# EAGLE design OpenServoCAN_Power_Board_V_1_0_1 (EAGLE 9.6.2)
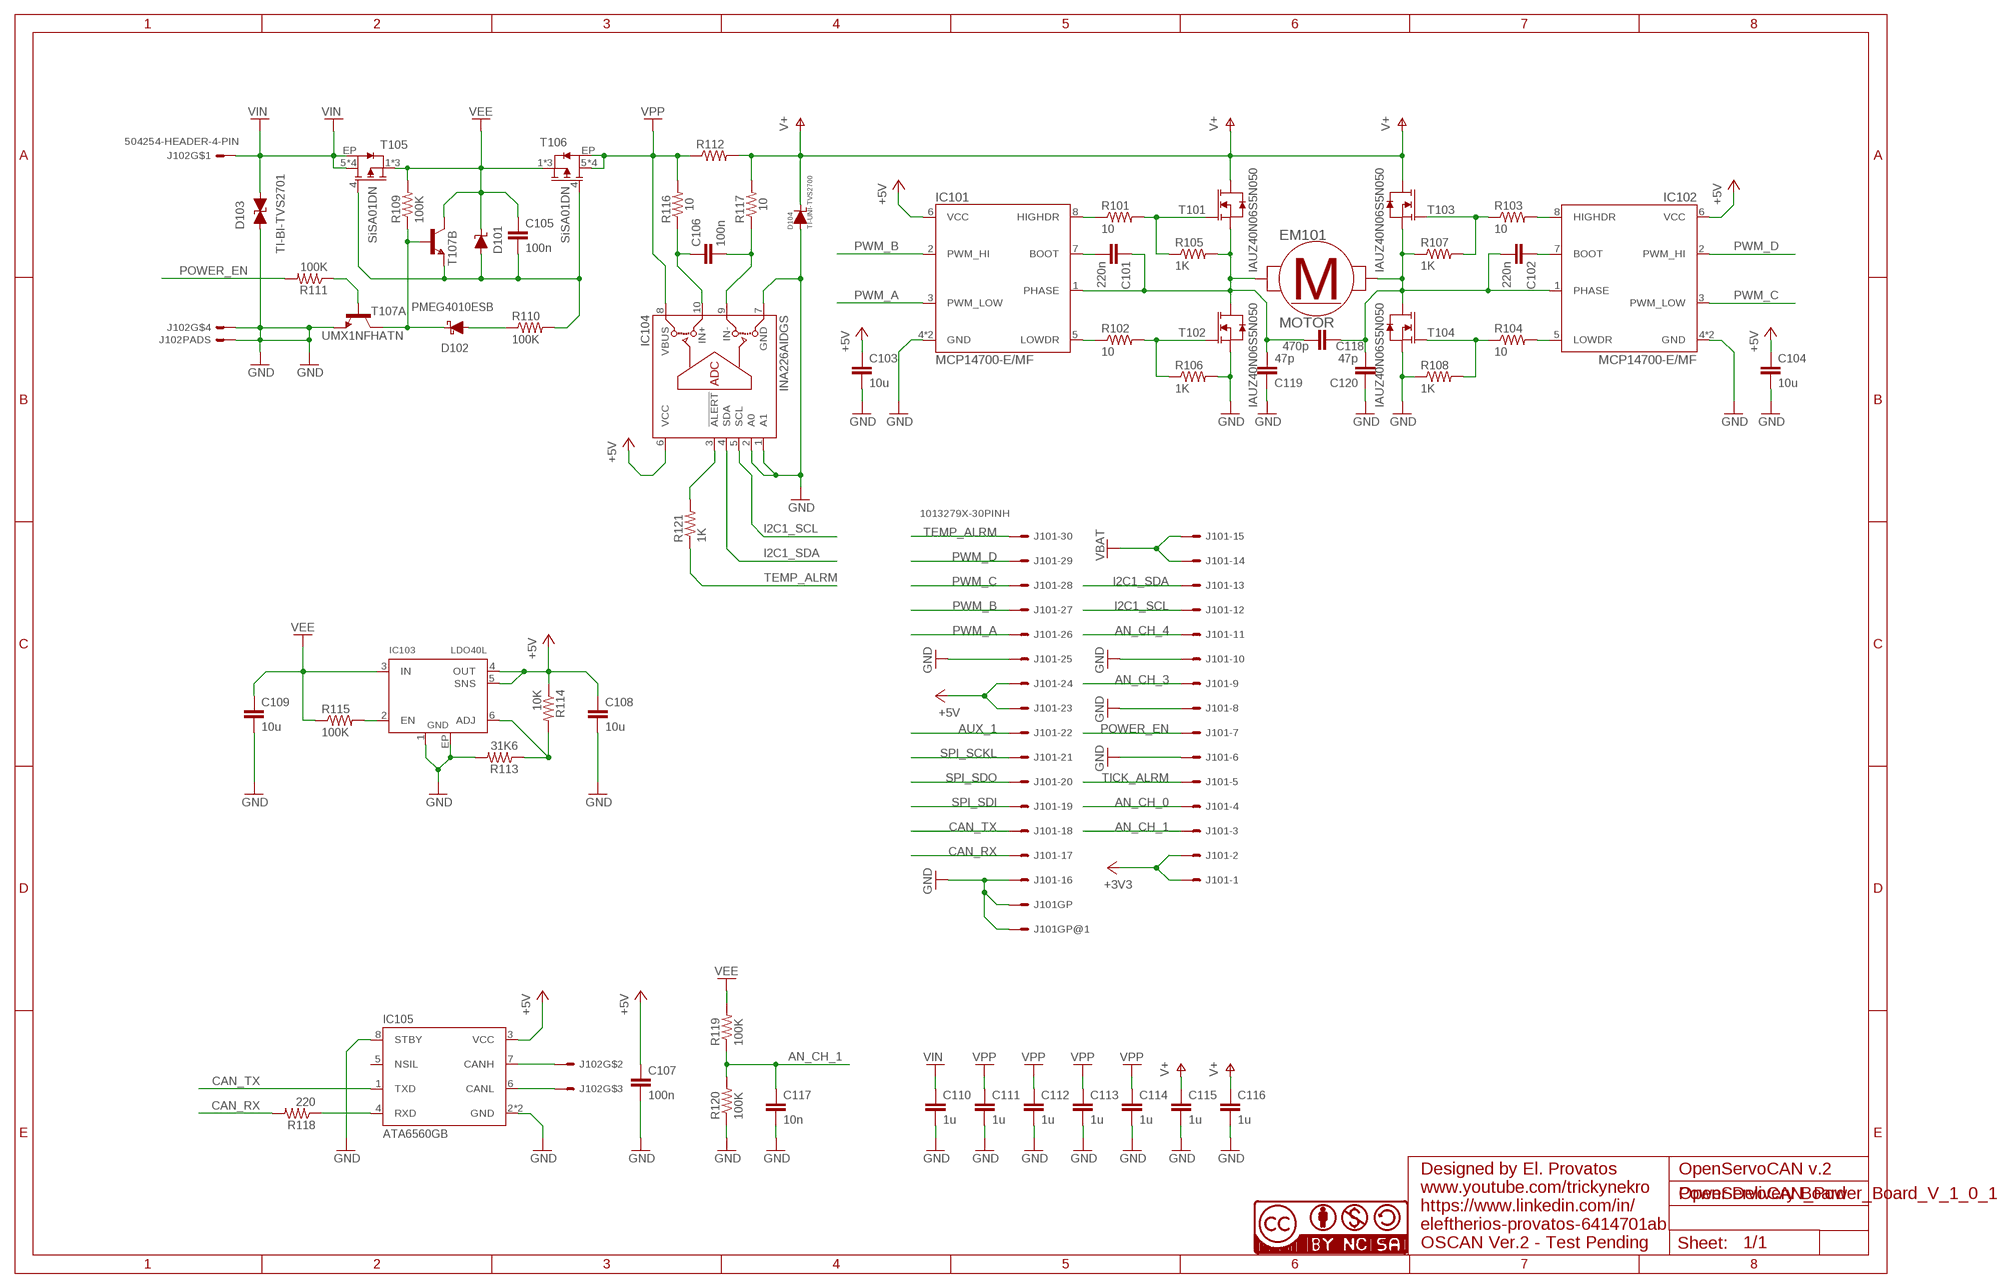
[diagram p0: schematic, sheet 1]

## Parts
C101  220n  C-EUC0603  [0603_C]
C102  220n  C-EUC0603  [0603_C]
C103  10u  C-EUC0402  [0402_C]
C104  10u  C-EUC0402  [0402_C]
C105  100n  C-EUC0402  [0402_C]
C106  100n  C-EUC0402  [0402_C]
C107  100n  C-EUC0402  [0402_C]
C108  10u  C-EUC0402  [0402_C]
C109  10u  C-EUC0402  [0402_C]
C110  1u  C-EUC0603  [0603_C]
C111  1u  C-EUC0603  [0603_C]
C112  1u  C-EUC0603  [0603_C]
C113  1u  C-EUC0603  [0603_C]
C114  1u  C-EUC0603  [0603_C]
C115  1u  C-EUC0603  [0603_C]
C116  1u  C-EUC0603  [0603_C]
C117  10n  C-EUC0402  [0402_C]
C118  470p  C-EUC1206  [1206_C]
C119  47p  C-EUC1206  [1206_C]
C120  47p  C-EUC1206  [1206_C]
D101  DDZ12CSF  [SOD-323]
D102  PMEG4010ESB  [DSN1006-2]
D103  TI-BI-TVS2701  [VSON-8-DRB0008A]
D104  TI-UNI-TVS2700  [WSON-6]
EM101  MOTOR  [RF-020TH-10210]
IC101  MCP14700-E/MF  [DFN_8_3X3X09_MF_MICROCHIP]
IC102  MCP14700-E/MF  [DFN_8_3X3X09_MF_MICROCHIP]
IC103  LDO40L  LDO40L-ADJ  [DFN6-3X3]
IC104  INA226AIDGS  [VSSOP-10]
IC105  ATA6560GB  [VDFN-8-EP]
J101  1013279X-30PINH  [10132797-30]
J102  504254-HEADER-4-PIN  [504254]
R101  10  R-USR0402  [0402_R]
R102  10  R-USR0402  [0402_R]
R103  10  R-USR0402  [0402_R]
R104  10  R-USR0402  [0402_R]
R105  1K  R-USR0402  [0402_R]
R106  1K  R-USR0402  [0402_R]
R107  1K  R-USR0402  [0402_R]
R108  1K  R-USR0402  [0402_R]
R109  100K  R-USR0402  [0402_R]
R110  100K  R-USR0402  [0402_R]
R111  100K  R-USR0402  [0402_R]
R112  TLR2HW-R-US-SENSE  [TLR2HW]
R113  31K6  R-USR0402  [0402_R]
R114  10K  R-USR0402  [0402_R]
R115  100K  R-USR0402  [0402_R]
R116  10  R-USR0402  [0402_R]
R117  10  R-USR0402  [0402_R]
R118  220  R-USR0402  [0402_R]
R119  100K  R-USR0402  [0402_R]
R120  100K  R-USR0402  [0402_R]
R121  1K  R-USR0402  [0402_R]
T101  IAUZ40N06S5N050  [PG-TSDSON-8-33-INF]
T102  IAUZ40N06S5N050  [PG-TSDSON-8-33-INF]
T103  IAUZ40N06S5N050  [PG-TSDSON-8-33-INF]
T104  IAUZ40N06S5N050  [PG-TSDSON-8-33-INF]
T105  SiSA01DN  SISA01DN  [POWERPAK-1212-8-SINGLE]
T106  SiSA01DN  SISA01DN  [POWERPAK-1212-8-SINGLE]
T107  UMX1NFHATN  [SC-70-6]
U$1  CC-NC-BCNIX  [CC-NC-B_NIX]

## Nets
+3V3: J101.1 J101.2
+5V: C103.1 C104.1 C107.1 C108.1 IC101.6(VCC) IC102.6(VCC) IC103.4(OUT) IC103.5(SNS) IC104.6(VCC) IC105.3(VCC) J101.23 J101.24 R114.1
AN_CH_0: J101.4
AN_CH_1: C117.1 J101.3 R119.1 R120.2
AN_CH_3: J101.9
AN_CH_4: J101.11
AUX_1: J101.22
CAN_RX: J101.17 R118.2
CAN_TX: IC105.1(TXD) J101.18
GND: C103.2 C104.2 C107.2 C108.2 C109.2 C110.2 C111.2 C112.2 C113.2 C114.2 C115.2 C116.2 C117.2 C119.1 C120.1 D103.5(A) D103.6(A) D103.7(A) D103.8(A) D104.1(A) D104.2(A) D104.3(A) D104.EP(A) IC101.4(GND) IC101.EP(GND) IC102.4(GND) IC102.EP(GND) IC103.1(GND) IC103.EP(GND) IC104.1(A1) IC104.2(A0) IC104.7(GND) IC105.2(GND) IC105.8(STBY) IC105.EP(GND) J101.6 J101.8 J101.10 J101.16 J101.25 J101.EP@2 J101.EP@↑1 J102.4 J102.EP@1 J102.EP@2 J102.EP@3 J102.EP@4 R106.2 R108.1 R113.2 R120.1 T102.S T104.S T107.1(A:E)
I2C1_SCL: IC104.5(SCL) J101.12
I2C1_SDA: IC104.4(SDA) J101.13
N$1: C101.1 C118.2 C119.2 EM101.1B EM101.1T IC101.1(PHASE) R105.2 T101.S T102.D
N$2: C102.2 C118.1 C120.2 EM101.2B EM101.2T IC102.1(PHASE) R107.1 T103.S T104.D
N$3: R103.1 R107.2 T103.G
N$4: IC101.8(HIGHDR) R101.1
N$5: R101.2 R105.1 T101.G
N$6: IC102.8(HIGHDR) R103.2
N$7: IC104.3(!ALERT) R121.2
N$8: R102.2 R106.1 T102.G
N$9: IC101.5(LOWDR) R102.1
N$10: R104.1 R108.2 T104.G
N$11: IC102.5(LOWDR) R104.2
N$13: C102.1 IC102.7(BOOT)
N$14: IC103.6(ADJ) R113.1 R114.2
N$15: C101.2 IC101.7(BOOT)
N$16: IC103.2(EN) R115.2
N$19: C106.1 IC104.10(IN+) R116.1
N$20: C106.2 IC104.9(IN-) R117.1
N$21: IC105.7(CANH) J102.2
N$22: IC105.6(CANL) J102.3
N$24: D102.K R109.1 T107.5(B:B) T107.6(A:C)
N$26: D102.A R110.1
N$27: C105.2 D101.A R110.2 T105.4(G) T106.4(G) T107.4(B:E)
N$28: R111.1 T107.2(A:B)
N$29: IC105.4(RXD) R118.1
POWER_EN: J101.7 R111.2
PWM_A: IC101.3(PWM_LOW) J101.26
PWM_B: IC101.2(PWM_HI) J101.27
PWM_C: IC102.3(PWM_LOW) J101.28
PWM_D: IC102.2(PWM_HI) J101.29
SPI_SCKL: J101.21
SPI_SDI: J101.19
SPI_SDO: J101.20
TEMP_ALRM: J101.30 R121.1
TICK_ALRM: J101.5
V+: C115.1 C116.1 D104.4(K) D104.5(K) D104.6(K) R112.2 R117.2 T101.D T103.D
VBAT: J101.14 J101.15
VEE: C105.1 C109.1 D101.K IC103.3(IN) R109.2 R115.1 R119.2 T105.1(S) T105.2(S) T105.3(S) T106.1(S) T106.2(S) T106.3(S) T107.3(B:C)
VIN: C110.1 D103.1(K) D103.2(K) D103.3(K) D103.4(K) J102.1 T105.5(D) T105.6(D) T105.7(D) T105.8(D) T105.EP(D)
VPP: C111.1 C112.1 C113.1 C114.1 IC104.8(VBUS) R112.1 R116.2 T106.5(D) T106.6(D) T106.7(D) T106.8(D) T106.EP(D)
Unconnected: IC105.5(NSIL)

## Notes on the sheet
- Designed by El. Provatos | OpenServoCAN v.2
- www.youtube.com/trickynekro
- Power Delivery Board
- https://www.linkedin.com/in/
  eleftherios-provatos-6414701ab
- OSCAN Ver.2 - Test Pending

## Library data of the parts
C101-C120 = TRN_Open_Servo:C-EUC: Standard 0402 Capacitor with European Symbol
D101 = TRN_Open_Servo:DDZ12: DDZ12CSF 0.5W SURFACE MOUNT PRECISION 12V ZENER DIODE from Diodes Incorporated in SOD-323F-2 Package Features 500mW Power Dissipation on FR-4 PCB Very Tight Tolerance on Vz Ideally Suited for Automated Assembly Processes Totally Lead-Free & Fully RoHS Compliant Halogen and Antimony Free.
D102 = TRN_Open_Servo:PMEG4010: PMEG4010 Schottky Barrier Diode 40V 1A Planar Maximum Efficiency General Application (MEGA) Schottky barrier rectifier with anintegrated guard ring for stress protection in a leadless ultra small DSN1006-2 (SOD993)Surface-Mounted Device (SMD) package.
D103 = TRN_Open_Servo:TI-BI-TVS: TVSxx01 Series of Texas Instruments Fast-Clamp TVS The TVSxx00 family of products includes as of 06 - 10 - 2020 the following: TVS0701 <https://www.ti.com/lit/ds/symlink/tvs0701.pdf>, TVS1401 <https://www.ti.com/lit/ds/symlink/tvs1401.pdf>, TVS1801 <https://www.ti.com/lit/ds/symlink/tvs1801.pdf>, TVS2201 <https://www.ti.com/lit/ds/symlink/tvs2201.pdf>, TVS2701 <https://www.ti.com/lit/ds/symlink/tvs2701.pdf>, TVS3301 <https://www.ti.com/lit/ds/symlink/tvs3301.pdf> The TVSxx01 device shunts up to 30/30/30/30/27/27 A of IEC 61000-4-5 fault current to protect systems from high-power transients or lightning strikes. The device survives the common industrial signal line EMC requirement of 1 kV IEC 61000-4-5 open circuit voltage coupled through a 42Ω impedance. The TVSxx01 uses a feedback mechanism to ensure precise flat clamping during a fault, keeping system exposure lower than traditional TVS diodes. The tight voltage regulation allows designers to confidently select system components with a lower voltage tolerance, lowering system costs and complexity without sacrificing robustness. The TVSxx01 has a ± 7/14/18/22/27/33 V operating range to enable operation in systems that require protection against reverse wiring conditions. In addition, the TVSxx01 is available in a small SON footprint which is designed for space constrained applications, offering a significant size reduction compared to standard SMA and SMB packages. Low device leakage and capacitance ensure a minimal effect on the protected line. To ensure robust protection over the lifetime of the product, TI tests the TVSxx01 against 5,000 repetitive surge strikes at 125°C with no shift in the device perfomance. The TVSxx01 is part of TI´s Flat-Clamp family of surge devices. For a deeper look at the Flat-Clamp family, refer to Flat-Clamp Surge Protection Technology for Efficient System Protection <https://www.ti.com/lit/wp/slyy127/slyy127.pdf> white paper.
D104 = TRN_Open_Servo:TI-UNI-TVS: TVSxx00 Series of Texas Instruments Fast-Clamp TVS The TVSxx00 family of products includes as of 06 - 10 - 2020 the following: TVS0500 <https://www.ti.com/lit/ds/symlink/tvs0500.pdf>, TVS1400 <https://www.ti.com/lit/ds/symlink/tvs1400.pdf>, TVS1800 <https://www.ti.com/lit/ds/symlink/tvs1800.pdf>, TVS2200 <https://www.ti.com/lit/ds/symlink/tvs2200.pdf>, TVS2700 <https://www.ti.com/lit/ds/symlink/tvs2700.pdf>, TVS3300 <https://www.ti.com/lit/ds/symlink/tvs3300.pdf> The TVSxx00 robustly shunts up to 40A of IEC 61000-4-5 fault current to protect systems from high power transients or lighting strikes. The device offers a solution to the common industrial signal line EMC requirement to survive up to ±1 kV IEC 61000-4-5 open circuit voltage coupled through a 42Ω impedance. The TVSxx00 uses a unique feedback mechanism to ensure precise flat clamping during a fault, assuring system exposure below 10/20/25/30/35/40V. The tight voltage regulation allows designers to confidently select system components with a lower voltage tolerance, lowering system costs and complexity without sacrifing robustness. In addition, the TVSxx00 is available in a small 2 x 2 mm SON footprint which is designed for space constrained applications, offering a 70 percent reduction in size compared to industry standard SMA and SMB packages. The extremely low device leakage and capacitance ensure a minimal effect on the protected line. To ensure robust protection over the lifetime of the product, TI tests the TVSxx00 against 5,000 repetitive surge strikes at high temperature with no shift in device performance. The TVSxx00 is part of TI´s Flat-Clamp family of surge devices. For more information on the other devices in the family, see the Device Comparison Table <https://www.ti.com/lit/ds/symlink/tvs2700.pdf?ts=1601973186018&ref_url=https%253A%252F%252Fwww.ti.com%252Fproduct%252FTVS2700#%5B%7B%22num%22%3A75%2C%22gen%22%3A0%7D%2C%7B%22name%22%3A%22XYZ%22%7D%2C0%2C720%2C0%5D>.
EM101 = TRN_Open_Servo:MOTOR: Generic Motor Symbol with various footprints
IC101 IC102 = TRN_Open_Servo:MCP14700: MCP14700 The MCP14700 is a high-speed synchronous MOSFET driver designed to optimally drive a high-side and low-side N-Channel MOSFET. It is particularly well suited for driving low-FOM MOSFETs, including Microchip’s MCP87000 family of high-speed MOSFETs. The MCP14700 has two PWM inputs to allow independent control of the external N-Channel MOSFETs. Since there is no internal cross conduction protection circuitry the external MOSFET dead time can be tightly controlled allowing for more efficient systems or unique motor control algorithms. The transition thresholds for the PWM inputs are typically 1.6V on a rising PWM input signal and typically 1.2V on a falling PWM input signal. This makes the MCP14700 ideally suited for controllers that utilize 3.0V TTL/CMOS logic. The PWM inputs are internally pulled low ensuring the output drive signals are low if the inputs are floating. The HIGHDR and LOWDR peak source current capability of the MCP14700 device is typically 2A. While the HIGHDR can sink 2A peak typically, the LOWDR can sink 3.5A peak typically. The low resistance pull-up and pull-down drive allow the MCP14700 to quickly transition a 3300 pF load in typically 10 ns. Bootstrapping for the high-side drive is internally implemented which allows for a reduced system cost and design complexity. The MCP14700 features undervoltage lockout (UVLO) with a typical hysteresis of 500 mV. Overtemperature protection with hysteresis is also featured on the device.
IC103 = TRN_Open_Servo:LDO40L: LDO40L Description The LDO40L is a 400 mA LDO regulator, designed for being used in severe automotive environments. Low quiescent current makes it suitable for applications permanently connected to battery. This feature is especially critical when electronic modules remain in active mode when ignition is off. The LDO40L embeds protection functions, such as: current limit and thermal-shutdown. The extended input voltage range, low drop voltage and low quiescent current features make it suitable also for low power industrial and consumer applications. Applications Automotive Applications Body control modules Instruments and clusters Automotive LED lighting Features Low quiescent current: typ. 45 μA at no load Wide input voltage operating range up to 38 V Low startup voltage: 3.5 V Output current up to 400mA Output voltage options: Adj from 2.5 V and fixed, 3.0, 3.3, 5.0 and 8.5 V Output voltage accuracy: ± 1% typ. @ 25 °C ± 3% (including line, load and temperature variation) Ultra low dropout: 36mV @ 100mA load current 140mV @ 400mA load current High PSRR: 70db @ 1kHz Very low noise: 20 μVRMS / VOUT Protection features: current limitation, thermal shutdown -40 °C to +125 °C operating temperature range Package: DFN6 (3x3) (wettable flanks) AEC-Q100 qualified (grade 1)
IC104 = TRN_Open_Servo:INA226: INA226 The INA226 is a current shunt and power monitor with an I²C or SMBUS compatible interface. The device monitors both a shunt voltage drop and bus supply voltage. Programmable calibration value, conversion times, and averaging, combined with an internal multiplier, enable direct readouts of current in amperes and power in watts. The INA226 senses current on common-mode bus voltages that can vary from 0 V to 36 V, independent of the supply voltage. The device operates from a single 2.7 V to 5.5 V supply, drawing a typingcal of 330μA of supply current. The device is specified over the operating temperature range bet- -ween -40°C and +125°C and features up to 16 programmable addresses on the i²C compatible interface. Link to Datasheet <https://www.ti.com/lit/ds/symlink/ina226.pdf>
IC105 = TRN_Open_Servo:ATA6560: ATA6560 High-Speed CAN Transceiver with Standby Mode CAN FD Ready General Description The ATA6560/1 is a high-speed CAN transceiver that provides an interface between a Controller Area Net-work (CAN) protocol controller and the physical two-wire CAN bus. The transceiver is designed for high-speed (up to 5 Mbps) CAN applications in the automotive industry, providing differential transmit and receive capability to (a microcontroller with) a CAN protocol controller. If offers improved Electromagnetc Compatibility (EMC) and ESD performance, as well as features such as: Ideal passive behavior to CAN bus when the supply is off Direct interfacing to microcontrollers with supply voltages from 3V to 5V Three operating modes, together with the dedicated fail-safe features, make the ATA6560/1 an exellent choice for all types of high-speed CAN networks, expecially in nodes requiring a Low-Power mode with wake-up via the CAN bus. Features Fully ISO 11898-2, ISO 11898-5 and SAE J2284 Compliant CAN FD Ready Communication Speed up to 5Mbps Low Electromagnetic Emission (EME) and High Electromagnetic Immunity (EMI) Differential Reciever with Wide Common-Mode Range ATA6560: Silent Mode (Reciever Only) Remote Wake-Up Capability via CAN Bus Functional Behavior Predictable under All Supply Conditions Transceiver Disengages from the Bus when Not Powered Up RXD Recessive Clamping Detection High Electrostatic Discharge (ESD) Handling Capability on the Bus Pins Bus Pins Protected Against Transients in Automotive Environments Transmit Data (TXD) Dominant Time-Out Function Undervoltage Detection on Vcc and VIO Pins CANH/CANL Short-Circuit and Overtemperature Protected Qualified According to AEC-Q100: Only ATA6560-GAQW, ATA6560-GBQW ATA6561-GAQW, ATA6561-GBQW Packages: SOIC-8, VDFN-8 with Wettable Flanks (Moisture Sensitivity Level 1) Applications Classical CAN and CAN FB networks in the following applications: Automotive Industrial Aerospace Medical Consumer 2018 Microchip Technology Inc. Document Reference No.: DS20005991A
J101 = TRN_Open_Servo:1013279X-30PIN: Amphenol BergStak® 0.5mm Mezzanine Connector 20 Pin Variant Header / Receptacle
J102 = TRN_Open_Servo:504254-HEADER-4-PIN: 504254 ERNI designation: M 1.27 MCB-A SMT 04-pin
R101-R111 R113-R121 = TRN_Open_Servo:R-USR: Standard 0402 Resistor with American Symbol
R112 = TRN_Open_Servo:TLR2HW-R-US-SENSE: TLR2HB Current Sense Resistor Series by KOA Speer Featuring: Ultra-low TCR (+50ppm/°C) available Metal alloy: superior corrosion and heat resistance Applications include current sensing, voltage division and pulse applications Ultra low resistance (0.5mΩ - 20mΩ) Suitable for reflow soldering (Not suitable for flow soldering) Products with lead-free terminations meet EU RoHS and China RoHS requirements AEC-Q200 Qualified
T101-T104 = TRN_Open_Servo:IAUZ40N06S5N050: IAUZ40N06S5N050 N Channel MOSFET by Infineon Featuring: OptiMOSTM power MOSFET for automotive applications N-Channel - Enchancement mode - Normal level MSL1 up to 260°C peak reflow 175°C operating temperature Green product (RoHS compliant) 100% Avalanche tested
T105 T106 = TRN_Open_Servo:SISA01DN: SiSA01DN P-Channel 30V (D-S) MOSFET FEATURES TrenchFET® Gen IV p-channel power MOSFET Provides exceptionally low RDS(ON) in a compact package that is thermally enhanced Enables higher power density 100% Rg and UIS tested Material categorization: for definitions of compliance please see: Document No. 99912 APPLICATIONS Battery management in mobile devices Adapter and charger switch Battery switch Load switch
T107 = TRN_Open_Servo:UMX1NFHA: UMX1NFHA General Purpose Transistor (Dual Transistors)
U$1 = cc-by-nc-sa:CC-NC-BC: All hardware is licensed under the Creative Commons Attribution-Noncommercial-Share Alike 2.5 Switzerland License. To view a copy of this license, visit http://creativecommons.org/licenses/by-nc-sa/2.5/ch/ or send a letter to Creative Commons, 171 Second Street, Suite 300, San Francisco, California, 94105, USA.

## Board
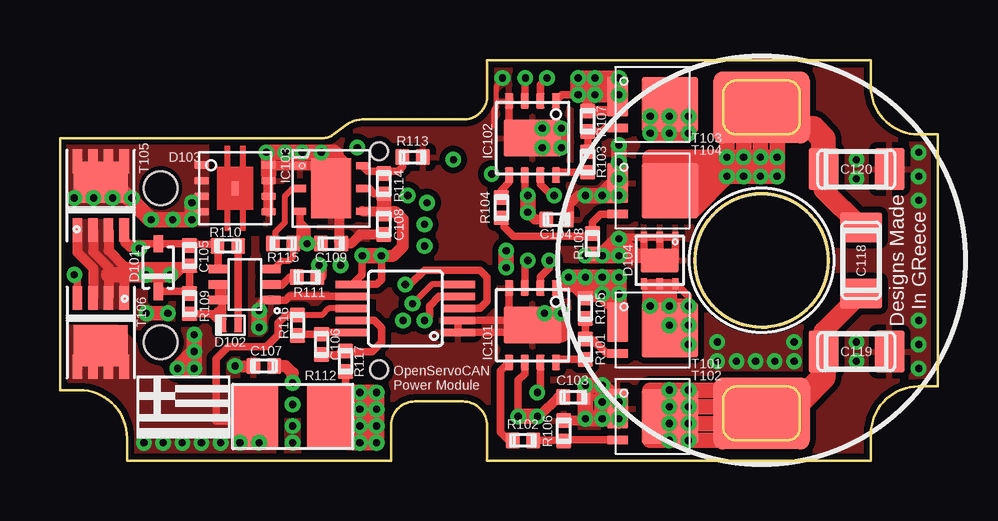
[diagram p1: board, top side]
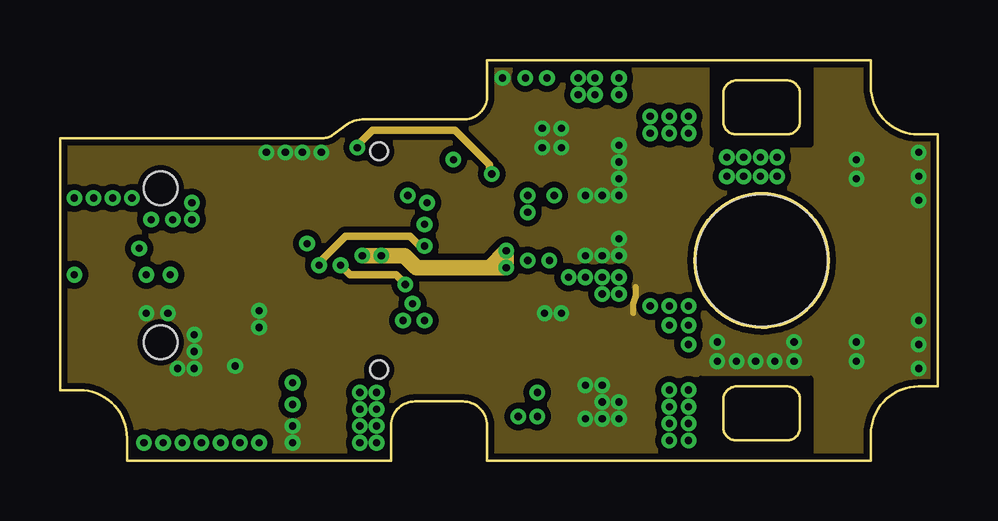
[diagram p2: board, inner layer Route2]
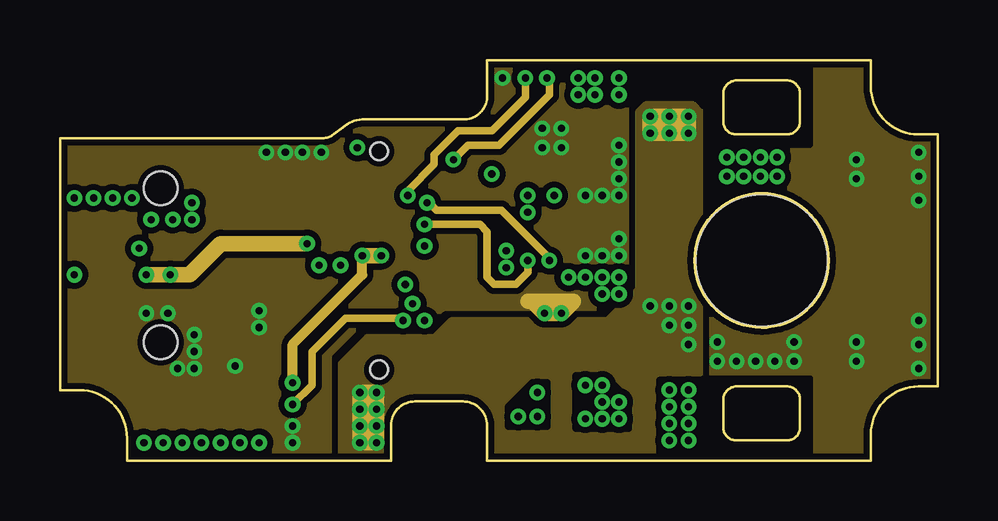
[diagram p3: board, inner layer Route15]
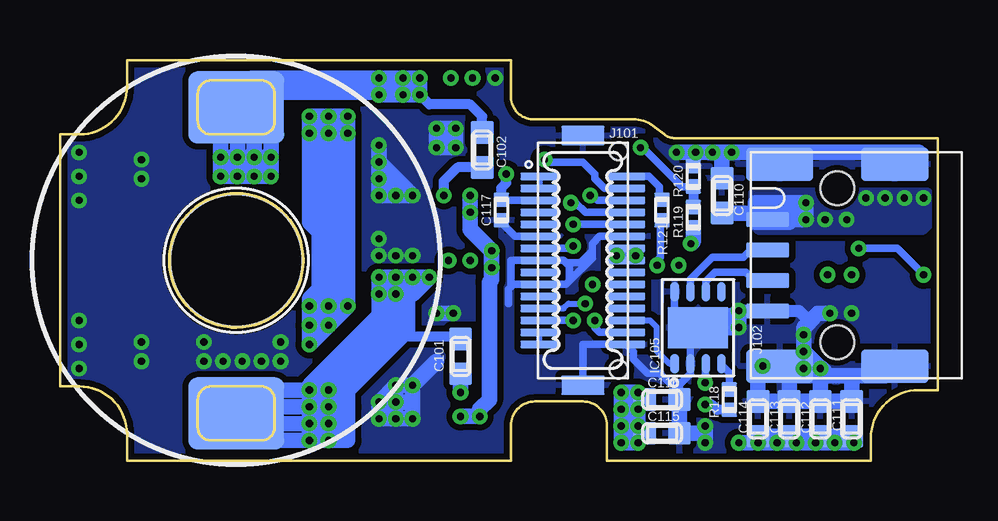
[diagram p4: board, bottom side, seen from below]

Size 36.6 x 16.7 mm. Coordinates in mm from the lower left corner, seen from the top.
Outline: 2.8,0 13.8,0 13.8,1.47 arc-90 14.8,2.47 16.8,2.47 arc-90 17.8,1.47 17.8,0 33.8,0 33.8,1.1 arc-90 35.8,3.1 36.6,3.1 36.6,13.6 35.8,13.6 arc-90 33.8,15.6 33.8,16.7 17.8,16.7 17.8,15.22 arc-90 16.89,14.22 12.7,14.22 arc45 11.8,13.9 11.4,13.6 arc-45 10.9,13.45 0,13.45 0,2.95 0.8,2.95 arc-90 2.8,0.95 2.8,0
Copper layers (1+2*15+16): Top 0.018mm / dielectric 0.2mm / Route2 0.035mm / dielectric 0.36mm / Route15 0.035mm / dielectric 0.2mm / Bottom 0.018mm
Design rules "default *": minimum track width 6mil, minimum drill 0.3mm, track to track 6mil, track to pad 6mil, pad to pad 6mil, via to via 6mil, smd to smd 6mil, copper to edge 8mil, drill to drill 6mil, minimum pad ring 10mil, minimum via ring 5mil, stop-mask expansion 3mil, vias tented up to drill 15mil, thermal gap 10mil
Holes 5.5 mm at 29.25,8.35
tRestrict: area 6.3,9.8 to 8.1,13.1

### Footprints (pad centres in the part's own frame; a part is rotated, then mirrored left to right if it is on the bottom)
0603_C = smd 0.95 x 0.95: 1 -0.725,0; 2 0.725,0
0402_C = smd 0.6 x 0.65: 1 -0.425,0; 2 0.425,0
1206_C = smd 1.25 x 1.75: 1 -1.375,0; 2 1.375,0
SOD-323 = smd 0.403 x 0.71: A 0,0.995; K 0,-0.995
DSN1006-2 = smd 0.6 x 0.35: A 0,-0.325; K 0,0.325
VSON-8-DRB0008A = smd 0.6 x 0.32: 1 -1.4,0.975; 2 -1.4,0.325; 3 -1.4,-0.325; 4 -1.4,-0.975; 5 1.4,-0.975; 6 1.4,-0.325; 7 1.4,0.325; 8 1.4,0.975 | smd 0.32 x 0.6: EP 0,0
WSON-6 = smd 0.45 x 0.3: 1 -0.975,0.65; 2 -0.975,0; 3 -0.975,-0.65; 4 0.975,-0.65; 5 0.975,0; 6 0.975,0.65 | smd 1 x 1.6: EP 0,0
RF-020TH-10210 = smd 3 x 4 bottom: 1B -6.375,0; 2B 6.375,0 | smd 3 x 4: 1T -6.375,0; 2T 6.375,0
DFN_8_3X3X09_MF_MICROCHIP = smd 0.65 x 0.35: 1 -1.55,0.975; 2 -1.55,0.325; 3 -1.55,-0.325; 4 -1.55,-0.975; 5 1.55,-0.975; 6 1.55,-0.325; 7 1.55,0.325; 8 1.55,0.975 | smd 1.55 x 2.4: EP 0,0
DFN6-3X3 = smd 0.5 x 0.3: 1 -1.3,0.95; 2 -1.3,0; 3 -1.3,-0.95; 4 1.3,-0.95; 5 1.3,0; 6 1.3,0.95 | smd 1.68 x 2.5: EP 0,0
VSSOP-10 = smd 1.45 x 0.3: 1 -2.2,1; 2 -2.2,0.5; 3 -2.2,0; 4 -2.2,-0.5; 5 -2.2,-1; 6 2.2,-1; 7 2.2,-0.5; 8 2.2,0; 9 2.2,0.5; 10 2.2,1
VDFN-8-EP = smd 0.8 x 0.35: 1 -1.5,0.975; 2 -1.5,0.325; 3 -1.5,-0.325; 4 -1.5,-0.975; 5 1.5,-0.975; 6 1.5,-0.325; 7 1.5,0.325; 8 1.5,0.975 | smd 1.7 x 2.5: EP 0,0
10132797-30 = smd 1.6 x 0.3: 1 -1.8,3.5; 2 -1.8,3; 3 -1.8,2.5; 4 -1.8,2; 5 -1.8,1.5; 6 -1.8,1; 7 -1.8,0.5; 8 -1.8,0; 9 -1.8,-0.5; 10 -1.8,-1; 11 -1.8,-1.5; 12 -1.8,-2; 13 -1.8,-2.5; 14 -1.8,-3; 15 -1.8,-3.5; 16 1.8,-3.5; 17 1.8,-3; 18 1.8,-2.5; 19 1.8,-2; 20 1.8,-1.5; 21 1.8,-1; 22 1.8,-0.5; 23 1.8,0; 24 1.8,0.5; 25 1.8,1; 26 1.8,1.5; 27 1.8,2; 28 1.8,2.5; 29 1.8,3; 30 1.8,3.5 | smd 1.8 x 0.8: EP@2 0,-5.2; EP@↑1 0,5.2 | hole 0.75: 1.5,-4.55; 1.5,4.55
504254 = smd 0.6 x 1.8: 1 1.905,2.9; 2 0.635,2.9; 3 -0.635,2.9; 4 -1.905,2.9 | smd 1.4 x 2.8: EP@1 -4.21,2.4; EP@2 -4.21,-2.4; EP@3 4.21,-2.4; EP@4 4.21,2.4 | hole 1.4: -3.21,0; 3.21,0
0402_R = smd 0.6 x 0.65: 1 -0.425,0; 2 0.425,0
TLR2HW = smd 1.9 x 2.7: 1 -1.55,0; 2 1.55,0
PG-TSDSON-8-33-INF = smd 2.3 x 2.36: D 0,0.725 | smd 0.35 x 0.9: G 0.975,-1.45 | smd 1.64 x 0.9: S -0.325,-1.45
POWERPAK-1212-8-SINGLE = smd 0.99 x 0.405: 1 -1.435,0.975; 2 -1.435,0.325; 3 -1.435,-0.325; 4 -1.435,-0.975; 5 1.435,-0.975; 6 1.435,-0.325; 7 1.435,0.325; 8 1.435,0.975 | smd 1.725 x 2.235: EP 0.557,0
SC-70-6 = smd 0.85 x 0.35: 1 -1.1,0.65; 2 -1.1,0; 3 -1.1,-0.65; 4 1.1,-0.65; 5 1.1,0; 6 1.1,0.65

### Placement (x,y rotation side)
C101  19.9,4.35 270 bottom
C102  19,12.95 90 bottom
C103  21.4,2.65 0 top
C104  20.7,10.05 0 top
C105  5.4,8.55 90 top
C106  10.9,4.85 270 top
C107  8.5,3.95 180 top
C108  13.5,9.85 270 top
C109  11.3,9.05 0 top
C110  9,11.05 90 bottom
C111  3.6,1.75 90 bottom
C112  4.9,1.75 90 bottom
C113  6.2,1.75 90 bottom
C114  7.5,1.75 90 bottom
C115  11.5,1.15 0 bottom
C116  11.5,2.55 0 bottom
C117  18.2,10.45 270 bottom
C118  33.4,8.35 270 top
C119  33.2,4.55 180 top
C120  33.2,12.15 180 top
D101  4.1,8.05 0 top
D102  7.1,5.65 90 top
D103  7.3,11.35 0 top
D104  25,8.35 270 top
EM101  29.25,8.35 90 bottom
IC101  19.7,5.65 270 top
IC102  19.7,13.45 270 top
IC103  11.3,11.35 0 top
IC104  14.4,6.35 180 top
IC105  10,5.55 90 bottom
J101  14.8,8.35 0 bottom
J102  4.2,8.15 90 bottom
R101  21.9,4.65 90 top
R102  19.3,0.85 0 top
R103  22,12.45 270 top
R104  18.4,10.55 90 top
R105  21.9,6.35 90 top
R106  21,1.25 90 top
R107  22,14.15 270 top
R108  22.2,9.05 90 top
R109  5.4,6.55 90 top
R110  7,8.95 180 top
R111  10.3,7.65 0 top
R112  9.7,1.85 0 top
R113  14.7,12.65 0 top
R114  13.5,11.55 90 top
R115  9.3,9.05 180 top
R116  9.9,5.65 90 top
R117  11.9,4.15 270 top
R118  8.7,2.55 270 bottom
R119  10.2,10.15 270 bottom
R120  10.2,11.85 270 bottom
R121  11.5,10.45 270 bottom
T101  24.7,5.45 270 top
T102  24.7,1.85 270 top
T103  24.7,14.85 270 top
T104  24.7,11.25 270 top
T105  1.7,11.05 90 top
T106  1.7,5.35 270 top
T107  7.7,7.35 180 top
U$1  -1,-0.35 0 top

### Tracks (layer width: path | path; a pad name or v marks a point on that pad's centre or on a via)
+3V3
  Bottom 0.254: J101.1 J101.2
+5V  (via drill 0.3 pad 0.65)
  Top 0.305: IC102.6 19.38,11.18 v19.5,11.05 | IC101.6 19.38,3.62 19.1,3.35 v19.1,1.85 | IC103.5 12.88,11.35 13.1,11.12 R114.1 | v13.4,8.55 13.4,7.55 13.2,7.35 IC104.6 12.6,7.75 v12.6,8.55
  Top 0.406: C104.1 19.8,10.05 v19.5,10.35 | C103.1 20.77,2.65 19.97,1.85 v19.9,1.85 | IC103.4 13.45,10.4 13.5,10.35
  Top 0.508: v9.7,3.25 9.7,3.65 9.4,3.95 C107.1 | v13.4,8.55 13.9,8.55 14.3,8.95 14.3,10.05 14,10.35 13.5,10.35
  Top 0.61: R114.1 13.5,10.35 C108.1
  Top 0.65: v19.5,11.05 v19.5,10.35 | v19.1,1.85 v19.9,1.85 | v12.6,8.55 v13.4,8.55 | v18.6,8.75 v18.6,8.05
  Route2 0.65: 17.9,8.05 v18.6,8.75 v18.6,8.05 14.87,8.05 14.37,8.55 v13.4,8.55 v12.6,8.55
  Route15 0.406: v9.7,3.25 9.7,4.85 12.6,7.75 v12.6,8.55
  Route15 0.65: v12.6,8.55 v13.4,8.55
  Bottom 0.254: J101.23 13.2,8.55 v13.4,8.55 | J101.24 12.7,8.55 v12.6,8.55
  Bottom 0.305: IC105.3 9.7,4.02 v9.7,3.25
  Bottom 0.65: v19.5,11.05 v19.5,10.35 19.5,9.65 v18.6,8.75 v18.6,8.05 18.6,7.55 18.7,7.45 18.7,2.55 19.1,2.15 v19.1,1.85 v19.9,1.85 | v12.6,8.55 v13.4,8.55
AN_CH_1  (via drill 0.3 pad 0.65)
  Route2 0.305: v18,11.95 17.9,12.05 17.9,12.34 16.46,13.78 13.03,13.78 12.4,13.15 v12.4,13.05
  Bottom 0.305: J101.3 18.18,10.85 C117.1 | v12.4,13.05 12.3,13.05 10.68,11.43 R120.2
  Bottom 0.406: C117.1 18.2,11.38 18,11.57 v18,11.95 | R120.2 R119.1
CAN_RX  (via drill 0.3 pad 0.65)
  Route15 0.305: v9.7,2.35 10.5,3.15 10.5,4.55 11.9,5.95 14.2,5.95 v14.3,5.85
  Bottom 0.305: J101.17 14.1,5.35 14.3,5.55 v14.3,5.85
  Bottom 0.406: R118.2 9.2,2.12 9.43,2.35 v9.7,2.35
CAN_TX
  Bottom 0.254: J101.18 12,5.85 11.73,5.58 11.73,4.58 11.2,4.05 IC105.1
CUTOUT
  cutout Route15: 21.5,1.35 21.5,3.55 22.7,3.55 23.7,2.55 23.7,1.35
  cutout Route15: 18.7,1.45 20.3,1.45 20.3,3.25 19.7,3.25 18.7,2.25
  cutout Route15: 26.8,3.25 26.8,0.45 25,0.45 25,3.35 26.8,3.35
  cutout Route2: 27.2,13.15 27.2,16.25 31.3,16.25 31.3,13.15
  cutout Route2: 26.7,3.45 31.3,3.45 31.3,0.45 26.7,0.45
  cutout Route15: 31.3,0.45 31.3,3.45 26.8,3.45 26.8,0.45
  cutout Route15: 27.2,13.15 31.3,13.15 31.3,16.25 27.2,16.25
GND  (via drill 0.3 pad 0.65)
  Top 0.203: 18.1,13.95 18.1,14.65 18.2,14.75 18.2,14.95 | 18.2,14.95 18.2,15.65 18.5,15.95 | 18.7,14.95 18.2,14.95
  Top 0.305: IC101.4 18.73,5.88 18.7,5.85 18.9,5.65 19.4,5.65 | 19.4,5.65 19.6,5.65 | 19.6,5.65 IC101.EP | IC102.4 18.73,13.88 18.7,13.85 19.1,13.45 IC102.EP v20.1,13.85 | v21.9,1.75 21.82,1.82 C103.2 22.6,2.65 | IC104.7 9.55,6.85 9.4,6.7 T107.1 8.5,6.7 8.3,6.5 v8.3,6.25 | D104.2 D104.EP 25.6,8.35 25.65,8.4 D104.1 D104.2 | D104.3 24.35,8.6 24.4,8.55 | D104.2 D104.3 | D104.3 23.38,9.32 v23.3,9.25 | 19.6,5.65 19.4,5.85 IC104.2 IC104.1 19.1,5.35 19.4,5.65 | C108.2 13.3,9.42
  Top 0.406: v21.9,1.75 21.82,1.67 R106.2 | C104.2 21.23,10.15 21.23,10.68 21.6,11.05 v21.9,11.05 | D103.5 D103.6 D103.7 D103.8 9.98,12.32 IC103.1 11.25,12.3 11.3,12.25 IC103.EP 11.3,10.85 11.62,10.52 11.62,9.15 C109.2 12.12,9.05 12.5,9.42 13.3,9.42
  Top 0.508: v7.3,3.95 C107.2
  Top 0.61: v3.6,6.15 v4.5,6.15 | v23.3,8.55 24,8.55 | 24,8.55 24.4,8.55 24.8,8.55 D104.EP | v23.3,9.25 24,8.55
  Top 0.65: v23.3,1.75 v23.3,2.45 | v23.3,2.45 v22.6,1.75 | v22.6,1.75 v21.9,1.75 v21.9,3.15 v22.6,3.15 23.1,2.65 | v22.6,1.75 v23.3,1.75 | v22.6,1.75 v22.6,2.45 22.6,2.65 23.1,2.65 | v23.3,13.15 v23.3,12.45 v23.3,11.75 | v23.3,11.75 v23.3,11.05 v22.6,11.05 | v22.6,11.05 v21.9,11.05 | v23.3,11.75 v22.6,11.05 | v20.1,13.85 v20.9,13.85 v20.9,13.05 | v20.9,13.05 v20.1,13.05 v20.1,13.85 | v20.1,13.85 v20.9,13.05 | 20.2,5.45 v20.2,6.15 IC101.EP | 20.2,5.45 20.1,5.35 20.1,5.25 20.9,5.25 v20.9,6.15 20.2,5.45 | v5.6,4.55 v5.6,3.85 v4.9,3.85 v5.6,4.55 | v5.6,4.55 v5.6,5.25 | v8.3,5.55 v8.3,6.25 | T102.S 23.3,2.12 v23.3,1.75 | 23.1,2.65 23.3,2.65 v23.3,2.45 | v21.9,8.55 v22.6,8.55 | v22.6,8.55 v23.3,8.55 v23.3,9.25 v22.6,8.55 | 11.45,12.7 11.8,12.35 | 8.7,11.95 8.7,12.75 v8.6,12.85 v9.4,12.85 v10.1,12.85 v10.9,12.85 11.4,12.85 11.5,12.75 11.45,12.7 | IC103.EP 11.3,12.55 11.45,12.7
  Route2 0.254: 23.9,6.15 23.9,6.55 24,6.85 24,7.25
  Route15 0.65: 19.7,6.65 21.4,6.65 v20.9,6.15 v20.2,6.15 19.7,6.65 | 19.5,6.65 19.7,6.65
  Bottom 0.305: IC105.8 10.98,6.22 10.8,6.05 10,6.05 10.33,5.72 IC105.2 10.33,3.62 10.78,3.17 | 12.8,4.85 J101.16 | C116.2 10.78,3.25 11.2,3.25 11.6,3.65 12.12,3.65 12.7,4.23 12.7,4.55 J101.16 | C114.2 7.52,2.47 | J101.6 17.62,9.35 18.2,9.92 C117.2 | J101.16 14.8,4.85 J101.EP@2 | 17.8,7.25 17.7,7.35 J101.10 15.5,7.35 15.35,7.5 | 17.8,7.25 17.9,7.15 17.9,6.55 | 17.8,7.25 17.8,8.35 J101.8 15.6,8.35 15.5,8.25 | J101.25 14.1,9.35 14.4,9.05 14.4,8.75 | 14.4,8.75 14.4,8.45 15.35,7.5 | 15.35,7.5 15.35,8.1 15.5,8.25 | 15.5,8.25 14.9,8.25 14.4,8.75
  Bottom 0.508: v8.3,6.25 J102.4 5.79,6.24 5.35,5.8
  Bottom 0.65: v21.9,1.75 v22.6,1.75 | 23,1.75 v23.3,1.75 v23.3,2.45 | v22.6,2.45 23,2.45 23,1.75 | v22.6,2.45 v22.6,1.75 | v22.6,1.75 23,1.75 | v22.6,11.05 v23.3,11.05 v23.3,11.75 | v23.3,11.75 v22.6,11.05 | v22.6,11.05 v21.9,11.05 v23.3,12.45 v23.3,11.75 | v23.3,11.75 v23.3,13.15 | v20.2,6.15 v20.9,6.15 | v20.1,13.05 v20.1,13.85 v20.9,13.85 | v20.9,13.85 v20.9,13.05 v20.1,13.05 | v20.1,13.05 v20.9,13.85 | 20.9,4.15 v21.9,3.15 21.9,2.45 | 22.6,1.95 v22.6,1.75 | v21.9,1.75 21.9,2.45 | 21.9,2.45 v22.6,2.45 | v22.6,2.45 22.1,2.45 21.9,2.25 v21.9,1.75 | v5.6,4.55 v5.6,5.25 5.6,5.55 5.35,5.8 5,6.15 v4.5,6.15 | v22.6,2.45 v23.3,2.45 | 22,3.15 v22.6,3.15 | v22.6,3.15 v22.6,2.45 | v22.6,3.15 v23.3,2.45 | v4.9,3.85 v5.6,4.55 | v5.6,4.55 v5.6,3.85 | v5.6,3.85 v4.9,3.85 | v7.3,3.95 7.5,3.75 C114.2 C111.2 3.6,3.55 | C113.2 6.2,3.54 | 6.2,3.54 J102.EP@1 | C112.2 v4.9,3.85 | 4.55,3.55 4.85,3.85 v5.6,3.85 | 3.6,3.55 4.55,3.55 | J102.EP@2 2.19,3.55 3.6,3.55 | 4.55,3.55 4.56,3.54 6.2,3.54 | C115.2 10.78,1.82 | v9.7,0.75 9.7,1.15 | 9.7,1.15 v9.7,1.45 | C115.2 9.7,1.15 | C116.2 C115.2 | v10.9,12.85 v10.1,12.85 v9.4,12.85 9,12.85 | 9,12.85 v8.6,12.85 6.6,12.85 | 6.6,12.85 1.9,12.85 | 1.9,12.85 0.8,12.85 | J102.EP@3 1.8,12.75 1.9,12.85 | J102.EP@4 6.6,12.85 | C110.2 9,12.85 | v8.3,5.55 v8.3,6.25 8.5,6.05 10,6.05 IC105.EP v8.3,5.55
  other vias: 35.8,12.85 35.8,11.85 35.8,10.85 35.8,5.85 35.8,4.85 35.8,3.85 33.2,4.15 33.2,4.95 33.2,12.55 33.2,11.75 18.45,15.95 30.6,4.15 30.6,4.95 29.8,4.15 29,4.15 28.2,4.15 27.4,4.15 27.4,4.95
  pour Route15 (isolate 0.254, rank 2): -0.2,16.85 -0.2,-0.15 36.8,-0.15 36.8,16.85
  pour Top (isolate 0.254, rank 2): -0.2,-0.15 36.8,-0.15 36.8,16.85 -0.2,16.85
  pour Route2 (isolate 0.254, rank 2): -0.2,-0.15 36.8,-0.15 36.8,16.85 -0.2,16.85
  pour Bottom (isolate 0.254, rank 2): -0.2,-0.15 36.8,-0.15 36.8,16.85 -0.2,16.85
I2C1_SCL  (via drill 0.3 pad 0.65)
  Top 0.254: IC104.5 15.5,7.35 v14.7,6.55
  Bottom 0.254: J101.12 15.6,6.35 15.4,6.55 v14.7,6.55
I2C1_SDA  (via drill 0.3 pad 0.65)
  Top 0.305: IC104.4 15.8,6.85 15.4,6.45 15.4,6.05 v15.2,5.85
  Bottom 0.305: J101.13 v15.2,5.85
N$1  (via drill 0.3 pad 0.65)
  Top 0.305: IC101.1 22.35,7.2 v22.6,6.95 22.43,6.77 R105.2 | T102.D 25.4,1.88 v25.4,2.25
  Top 0.65: v22.6,6.95 v21.9,7.65 | 23.3,6.25 v22.6,6.95 | 23.3,6.25 v23.3,6.95 | v25.4,2.95 24.6,2.95 24.6,2.25 v25.4,2.25 v26.2,2.25 | v25.4,2.95 v26.2,2.95 v26.2,2.25 | 24.6,0.85 v26.2,0.85 29,0.85 29.3,1.15 29.3,1.55 | 29.3,2.25 29.3,2.45 29.2,2.55 28.8,2.95 v25.4,2.95 | v26.2,2.25 29.3,2.25 | 29.3,2.25 29.3,1.55 | 29.3,1.55 28.6,1.55 24.6,1.55 | v21.2,7.65 21.8,7.05 | T101.S 23.25,6.2 23.3,6.25 | v21.2,7.65 v21.9,7.65 | v21.2,7.65 21.2,7.45 | v21.9,7.65 v22.6,7.65 | v22.6,7.65 v23.3,7.65 v23.3,6.95 | v23.3,6.95 v22.6,6.95 | v22.6,6.95 v22.6,7.65 | v22.6,7.65 v23.3,6.95
  Top 0.813: C118.2 31.82,5.4 C119.2
  Top 0.9: EM101.1B 28.82,1.55 28.6,1.55
  Top 1.016: C119.2 31.82,3.47 30.9,2.55 29.2,2.55
  Bottom 0.305: v25.4,1.55 v25.4,2.25
  Bottom 0.406: 22.4,7.15 v22.6,6.95 | 22.37,5.18 20,5.18 C101.1
  Bottom 0.65: 25.1,2.95 24.6,2.95 | v26.2,2.95 v26.2,2.25 | v26.2,2.25 v25.4,2.25 | 24.6,2.25 24.6,2.95 | v25.4,2.25 25.3,2.25 24.6,2.95 | v26.2,2.95 25.5,2.25 v25.4,2.25 | v26.2,2.95 v25.4,2.95 | v25.4,2.95 v25.4,2.25 | 24.6,2.95 22.37,5.18 | v22.6,6.95 22.3,6.95 22.1,6.75 22.1,5.45 | v22.6,6.95 23,6.95 | 23.3,6.05 23.3,5.85 | 23.3,5.85 25,4.15 | 25,4.15 25.4,3.75 | 25.4,3.75 v25.4,2.95 | v25.4,2.95 25.1,2.95 | 25.1,2.95 25.1,3.25 22.7,5.65 22.7,6.55 23,6.85 | 23,6.85 23,6.65 v23.3,6.95 | 23,6.85 23,6.95 | 23,6.95 v23.3,6.95 | 24.9,4.15 25,4.15 | 25.4,3.75 v26.2,2.95 | v26.2,2.95 26.2,3.15 23.3,6.05 | 23.3,6.05 v23.3,6.95 | v25.4,2.95 28.28,2.95 EM101.1B | 24.7,0.85 24.6,0.85 24.6,1.55 | 24.7,0.85 v25.4,0.85 v26.2,0.85 | v26.2,0.85 29.3,0.85 29.3,1.55 | 24.7,2.25 v25.4,2.25 | v25.4,1.55 24.7,0.85 | v26.2,0.85 v26.2,1.55 v26.2,2.25 | v26.2,2.25 25.5,1.55 v25.4,1.55 | v25.4,1.55 24.6,1.55 | 24.6,1.55 24.6,2.25 | 24.6,2.25 24.7,2.25 | 24.7,2.25 v25.4,1.55 | v25.4,1.55 26.1,0.85 v26.2,0.85 | v25.4,1.55 29.3,1.55 | v25.4,2.25 29.3,2.25 29.3,1.55 | 23.3,5.55 23.3,5.85 | v21.9,7.65 v21.2,7.65 21.9,6.95 v22.6,6.95 | v23.3,6.95 v23.3,7.65 v22.6,7.65 | v22.6,7.65 v21.9,7.65 | v21.9,7.65 v22.6,6.95 | v22.6,6.95 v22.6,7.65 | v22.6,7.65 v23.3,6.95
N$2  (via drill 0.3 pad 0.65)
  Top 0.305: 21.5,15.95 21.6,15.85 | IC102.1 20.93,15.25 v21.6,15.25 | 29.3,14.25 29.25,14.3 EM101.2T 29.73,14.25 29.8,14.25
  Top 0.406: 22,15.25 R107.1 23.05,14.57 23.25,14.77 T103.S
  Top 0.65: v21.6,15.95 v22.3,15.95 | 22.4,15.95 v23.3,15.95 v23.3,15.25 | v23.3,15.25 v22.3,15.25 | v22.3,15.25 22,15.25 v21.6,15.25 21.6,15.85 v21.6,15.95 | v21.6,15.95 v22.3,15.25 | v22.3,15.25 22.4,15.35 22.4,15.95 | 22.4,15.95 v22.3,15.95 | v22.3,15.95 23,15.25 v23.3,15.25 | v28.5,12.65 v29.2,12.65 | v29.2,11.85 v28.5,11.85 | v27.8,11.85 27.1,11.85 | 27.1,11.85 27.1,12.65 | 27.1,12.65 v27.8,12.65 | v27.8,12.65 v27.8,11.85 | v27.8,11.85 v28.5,11.85 | v28.5,11.85 v28.5,12.65 | v28.5,12.65 28.6,12.55 29.2,12.55 | v29.2,12.65 v29.2,11.85 | v29.2,11.85 v29.9,11.85 | v29.9,11.85 v29.9,12.65 | 29.9,11.95 v29.9,11.85 | v29.9,11.85 29.2,12.55 | 29.2,12.55 v29.2,12.65 | v29.2,12.65 28.5,11.95 v28.5,11.85 | v28.5,11.85 27.8,12.55 | v27.8,12.65 27.8,12.55 | 27.8,12.55 27.1,11.85 | 27.1,12.65 24.8,12.65 | 24.8,12.65 24.6,12.65 24.6,11.25 T104.D 25.4,11.22 25.4,10.45 26.4,10.45 v27.8,11.85 | 24.8,12.65 24.8,12.25 26.7,12.25 26.7,11.15 27.1,11.55 27.1,11.85 | 30.6,14.65 29.2,14.65 29.2,13.75 v29.2,12.65 | v29.2,12.65 v29.9,12.65 | v29.9,12.65 29.9,14.15 29.8,14.25 29.3,14.25 28.8,14.25 | 28.8,14.25 28.5,14.25 | 28.4,14.25 28.5,14.25 | 28.5,14.25 v28.5,12.65 | v28.5,12.65 v27.8,12.65 | v27.8,12.65 27.8,14.35 | EM101.2T 29.25,14.7 28.8,14.25
  Top 0.7: 23.3,15.22 T103.S
  Top 0.813: C118.1 31.82,11.3 C120.2
  Top 1.016: C120.2 31.82,13.43 31.4,13.85 29.3,13.85 29.2,13.75
  Bottom 0.305: EM101.2T 29.25,15 28.9,15.35
  Bottom 0.406: C102.2 19,14.35 19.5,14.85 21.2,14.85 v21.6,15.25
  Bottom 0.65: v21.6,15.95 23,15.95 | 23,15.95 v23.3,15.95 | v23.3,15.95 v23.3,15.25 | v23.3,15.25 v22.3,15.25 | v22.3,15.25 21.7,15.25 21.6,15.35 v21.6,15.95 | v21.6,15.95 v22.3,15.25 | v22.3,15.25 23,15.95 | v28.5,12.65 v29.2,12.65 | v29.9,11.85 v29.2,11.85 | v29.2,11.85 v28.5,11.85 | v28.5,11.85 v27.8,11.85 v27.8,12.65 | v27.8,12.65 27.8,12.55 v28.5,11.85 | v28.5,11.85 v28.5,12.65 | v28.5,12.65 28.5,12.55 v29.2,11.85 | v29.2,11.85 v29.2,12.65 | v29.2,12.65 29.2,12.55 v29.9,11.85 | v29.9,11.85 v29.9,12.65 | v29.9,12.65 29.9,12.55 | 30.6,14.75 29.2,14.75 | 29.2,14.75 v29.2,12.65 | v29.2,12.65 v29.9,12.65 | v29.9,12.65 29.9,14.65 28.5,14.65 v28.5,12.65 | v28.5,12.65 v27.8,12.65 | v27.8,12.65 27.8,14.55 28.7,14.55 | EM101.2T 29.23,14.72 29.2,14.75 | v23.3,15.95 28.6,15.95 29.3,15.25 29.3,14.95 | v23.3,15.25 23.4,15.35 28.9,15.35 29.3,14.95 | 29.3,14.95 29.3,14.45
N$3
  Top 0.305: T103.G 22.73,13.88 22.58,13.72 R107.2 R103.1
N$4
  Top 0.305: IC101.8 20.8,4.22 R101.1
N$5
  Top 0.305: T101.G 22.78,4.47 22.18,5.07 R101.2 R105.1
N$6
  Top 0.305: R103.2 20.8,12.02 IC102.8
N$7  (via drill 0.3 pad 0.65)
  Top 0.305: IC104.3 17.5,6.35 17.8,6.65 17.8,7.65 17.5,7.95 15.2,7.95 14.6,7.35 v14.4,7.35
  Route2 0.305: v11.7,8.15 12.1,7.75 14,7.75 v14.4,7.35
  Bottom 0.305: v11.7,8.15 11.7,8.35 11.57,8.48 11.57,9.96 R121.2
N$8
  Top 0.305: T102.G 21.05,0.88 R106.1 20.98,0.85 R102.2
N$9
  Top 0.305: IC101.5 18.37,3.74 18.37,1.18 18.7,0.85 R102.1
N$10
  Top 0.305: T104.G 22.53,10.28 22.2,9.95 R108.2 22.07,9.35 18.9,9.35 18.5,9.75 18.5,10.03 R104.1
N$11
  Top 0.305: IC102.5 18.73,11.6 18.4,11.27 R104.2
N$13  (via drill 0.3 pad 0.65)
  Top 0.305: IC102.7 20.03,11.52 20.5,11.05 v20.6,11.05
  Bottom 0.406: C102.1 20.03,12.22 20.6,11.65 v20.6,11.05
N$14
  Top 0.305: IC103.6 12.83,12.07 13.4,12.07 R114.2 13.6,12.07 14.1,12.07 14.28,12.25 R113.1
N$15  (via drill 0.3 pad 0.65)
  Top 0.305: IC101.7 20.03,2.97 v19.9,2.85
  Bottom 0.65: v19.9,2.85 C101.2
N$16
  Top 0.254: IC103.2 9.7,11.35 9.37,11.02 9.37,9.92 8.98,9.53 8.98,9.15 R115.2
N$19
  Top 0.305: IC104.10 10.98,5.35 C106.1 9.95,5.27 R116.1
N$20
  Top 0.254: R117.1 11.9,4.55
  Top 0.305: IC104.9 13.1,5.85 13.4,5.55 13.4,4.95 13,4.55 11.9,4.55 11.7,4.55 11.58,4.42 C106.2 10.83,4.35
N$21
  Bottom 0.305: IC105.7 10.33,7.57 9.41,8.48 8.1,8.48 7.8,8.79 J102.2
N$22
  Bottom 0.305: IC105.6 9.68,7.47 9.3,7.85 8,7.85 7.67,7.51 J102.3
N$24
  Top 0.254: T107.6 T107.5
  Top 0.305: R109.1 6.3,6.12 | 6.3,6.12 6.45,6.12 6.77,6.45 | 6.3,6.12 D102.K 6.77,6.45 | 6.77,6.45 6.77,6.52 T107.6 6.8,6.9 | 6.8,7 6.8,7.15 T107.5
N$26
  Top 0.305: D102.A R110.1
N$27  (via drill 0.3 pad 0.65)
  Top 0.254: C105.2 5.4,9.03 5.41,9.04
  Top 0.305: T106.4 0.73,7.62 v0.6,7.75 | v3.3,8.85 2.9,8.85 2.67,9.07 2.67,9.25 | 2.67,9.25 T105.4 | 2.67,9.25 2.88,9.04 3.49,9.04 v3.3,8.85 | 5.41,9.04 D101.A 3.49,9.04 v3.3,8.85 | R110.2 6.6,8.92 | 6.6,8.92 6.6,9.03 5.45,9.03 C105.2 | 6.6,8.92 T107.4
  Bottom 0.305: v0.6,7.75 1.7,8.85 v3.3,8.85
N$28
  Top 0.305: T107.2 8.83,7.32 9.24,7.32 9.57,7.65 R111.1
N$29
  Bottom 0.305: IC105.4 9.03,4 8.7,3.67 R118.1
POWER_EN  (via drill 0.3 pad 0.65)
  Top 0.508: 10.8,7.72 R111.2
  Top 0.65: v10.8,8.15 10.8,7.72
  Route2 0.305: v10.8,8.15 10.8,8.25 11.9,9.35 14.6,9.35 15,8.95 v15.2,8.95
  Bottom 0.305: J101.7 15.3,8.85 v15.2,8.95
PWM_A  (via drill 0.3 pad 0.65)
  Top 0.305: IC101.3 19.38,8.22 v19.5,8.35
  Route15 0.305: v19.5,8.35 19.5,7.85 19,7.35 18.1,7.35 17.8,7.65 17.8,9.55 17.5,9.85 v15.2,9.85
  Bottom 0.305: v15.2,9.85 J101.26
PWM_B  (via drill 0.3 pad 0.65)
  Top 0.305: IC101.2 20.03,7.67 20.4,8.05 v20.4,8.35
  Route15 0.305: v15.3,10.75 15.4,10.75 15.7,10.45 18.4,10.45 20.4,8.45 v20.4,8.35
  Bottom 0.305: J101.27 14.7,10.35 15.1,10.75 v15.3,10.75
PWM_C  (via drill 0.3 pad 0.65)
  Top 0.305: IC102.3 19.38,15.93 v19.4,15.95
  Route15 0.305: v14.5,11.05 14.5,11.25 15.6,12.35 15.6,12.75 16.6,13.75 18,13.75 19.4,15.15 v19.4,15.95
  Bottom 0.305: J101.28 14.2,10.85 14.4,11.05 v14.5,11.05
PWM_D  (via drill 0.3 pad 0.65)
  Top 0.305: IC102.2 20.03,15.68 v20.3,15.95
  Route15 0.305: v16.4,12.55 17,13.15 18.3,13.15 20.4,15.25 20.4,15.85 v20.3,15.95
  Bottom 0.305: J101.29 13.9,11.35 14.3,11.75 14.3,11.95 14.8,12.45 16.3,12.45 v16.4,12.55
TEMP_ALRM
  Bottom 0.305: R121.1 11.6,10.97 11.6,11.41 12.04,11.85 J101.30
V+  (via drill 0.3 pad 0.65)
  Top 0.305: 10.6,1.85 10.9,1.85 | 10.9,1.85 R112.2 | R117.2 11.9,2.85 10.9,1.85 | D104.4 D104.5 | D104.5 D104.6 25.68,7.38 26.2,6.85 v26.2,6.45 | D104.5 25,6.45 | T101.D 25.3,5.57 25.3,5.65 | T103.D 25.43,14.43 25.5,14.35
  Top 0.65: 25.4,7.25 v25.4,6.45 | v24.6,6.45 24.6,7.25 25.4,7.25 | 25.4,7.25 v24.6,6.45 | v24.6,6.45 25,6.45 v25.4,6.45 | v25.4,6.45 v26.2,6.45 v26.2,5.65 | v26.2,5.65 v25.4,5.65 | 25.3,5.65 v25.4,5.65 | v25.4,6.45 v25.4,5.65 | v25.4,5.65 v26.2,4.85 v26.2,5.65 | 11.8,2.15 v12.5,2.15 | v13.2,2.15 v12.5,2.15 | v13.2,2.15 v13.2,1.45 | v13.2,1.45 v13.2,0.75 v12.5,0.75 | v12.5,0.75 12,0.75 11.8,0.95 11.8,1.65 | 11.8,2.15 11.8,1.65 | v12.5,1.45 11.8,2.15 | v12.5,1.45 v12.5,0.75 | v12.5,2.15 v12.5,1.45 | v13.2,1.45 v12.5,2.15 | v13.2,1.45 v12.5,0.75 | R112.2 11.6,1.85 11.8,1.65 | v13.2,2.15 v12.5,2.85 | v12.5,2.85 11.8,2.85 11.8,2.15 | v13.2,2.15 v13.2,2.85 v12.5,2.85 | v12.5,2.85 v12.5,2.15 | v24.6,13.65 v25.4,13.65 v26.2,13.65 v26.2,14.35 25.5,14.35 v24.6,14.35 v24.6,13.65
  Route15 0.65: v13.2,2.15 v13.2,1.45 | v13.2,1.45 v13.2,0.75 v12.5,0.75 | v12.5,0.75 v12.5,1.45 v13.2,1.45 | v12.5,2.15 12.5,0.95 | v13.2,1.45 v12.5,2.15 | v13.2,1.45 v12.5,0.75 | v12.5,2.85 v13.2,2.85 v13.2,2.15 | v13.2,2.15 v12.5,2.15 | v12.5,2.15 v12.5,2.85 | v12.5,2.85 v13.2,2.15 | v24.6,14.35 v25.4,14.35 v26.2,14.35 | v26.2,14.35 v26.2,13.65 v25.4,13.65 | v25.4,13.65 v24.6,13.65 v24.6,14.35 | v24.6,14.35 24.7,14.35 v25.4,13.65 | v25.4,13.65 25.5,13.65 v26.2,14.35
  Bottom 0.65: v24.6,14.35 v25.4,14.35 | v25.4,14.35 v26.2,14.35 v26.2,13.65 | v26.2,13.65 25.8,13.65 | v24.6,14.35 v24.6,13.65 | v24.6,14.35 25.4,13.55 | v25.4,5.65 v24.6,6.45 | v24.6,6.45 v25.4,6.45 | v25.4,6.45 v26.2,6.45 | v26.2,6.45 v26.2,5.65 | v26.2,5.65 v26.2,4.85 v25.4,5.65 | v25.4,5.65 v25.4,6.45 | v25.4,6.45 v26.2,5.65 | v25.4,6.45 25.4,7.25 | 25.4,7.25 25,7.25 | 24.6,7.25 v24.6,6.45 | v24.6,6.45 25.4,7.25 | 25.4,7.25 25.4,13.55 | 25.4,13.55 v25.4,13.65 | v26.2,13.65 26.1,13.65 v25.4,14.35 | v25.4,14.35 v25.4,13.65 | 25,13.65 v24.6,13.65 | v24.6,13.65 24.6,7.25 | v26.2,6.45 26.2,6.75 25.8,7.15 25.8,9.55 26.2,9.95 v26.2,13.65 | 24.6,7.25 25,7.25 | 25,7.25 25,13.65 | 25,13.65 v25.4,13.65 | v25.4,13.65 25.8,13.65 | 25.8,13.65 25.8,6.05 v25.4,5.65 | v13.2,0.75 v13.2,1.45 | v13.2,1.45 v13.2,2.15 | v13.2,2.15 v13.2,2.85 v12.5,2.85 | v12.5,2.85 v12.5,2.15 | v12.5,2.15 v12.5,1.45 | v12.5,1.45 12.5,1.05 | 12.5,1.05 v12.5,0.75 v13.2,0.75 | v13.2,0.75 v12.5,1.45 | v12.5,1.45 v13.2,1.45 | v13.2,1.45 v12.5,2.15 | v12.5,2.15 v13.2,2.15 | v13.2,2.15 12.75,2.6 | 12.75,2.6 v12.5,2.85 | C116.1 12.28,2.6 12.75,2.6 | C115.1 12.4,1.15 12.5,1.05
  pour Route15 (isolate 0.254): 11.7,-0.15 24.9,-0.15 26.7,1.65 26.7,14.55 26.4,14.85 24.4,14.85 24.1,14.55 24.1,7.15 22.8,5.85 16.3,5.85 15.6,5.15 12.8,5.15 11.7,4.05
VBAT
  Bottom 0.254: J101.15 J101.14
VEE  (via drill 0.3 pad 0.65)
  Top 0.254: 5.46,8.06 C105.1 | 5.1,7.95 4.7,7.55 4.6,7.55 v4.6,7.75 4.6,7.95 5.1,7.95 | 5.2,8.05 5.1,7.95 | T107.3 8.9,8 9.25,8.35 9.56,8.35 9.73,8.51 R115.1
  Top 0.305: 2.68,8.06 2.67,8.05 | 4.1,8.12 C105.1 R109.2 5.32,7.05 D101.K 4.1,8.12 | 4.1,8.12 2.68,8.12 2.67,8.12 | IC103.3 10,9.95 | 10,9.95 10,9.32 R115.1 | 10,9.95 10.3,9.65 v10.3,9.05 C109.1
  Top 0.406: T105.1 0.73,8.69 1.38,8.03 1.38,6.79 T106.3 | T105.2 1.38,8.71 2.02,8.06 2.02,7.75 T106.2 | T106.1 2.67,8.05 2.67,8.12 2.02,8.76 T105.3 | C109.1 R115.1
  Top 0.65: v4.6,7.75 v3.6,7.75 2.02,7.75
  Route15 0.65: v3.6,7.75 v4.6,7.75 5.4,7.75 6.7,9.05 v10.3,9.05
  Bottom 0.508: R119.2 10.2,9.65
  Bottom 0.65: 10.2,9.65 10.2,9.15 v10.3,9.05
  pour Top (no thermals): 1.4,6.45 2.7,6.45 2.7,8.15 2.1,8.75 2.1,9.95 0.7,9.95 0.7,8.75 1.4,8.05
VIN  (via drill 0.3 pad 0.65)
  Top 0.65: v5.5,10.75 v5.5,10.05 3.77,10.05 2.67,11.15 2.16,11.15 T105.EP
  Bottom 0.65: v5.5,10.05 6.2,10.05 | 6.2,9.95 6.9,9.95 | 6.9,9.95 7.6,9.95 7.6,10.65 | 6.9,10.75 7.6,10.75 7.6,10.65 | 6.9,10.75 6.2,10.75 | 6.2,10.75 v5.5,10.75 v5.5,10.05 | 6.2,10.75 v5.5,10.05 | 6.2,10.75 6.2,10.05 | 6.2,10.05 6.2,9.95 | 6.2,9.95 6.9,10.65 | 6.9,10.65 6.9,10.75 | 6.9,10.65 6.9,9.95 | 6.9,9.95 7.6,10.65 | C110.1 7.22,10.32 6.9,10.65
  other vias: 4.7,10.05 3.8,10.05 0.6,10.95 1.4,10.95 2.2,10.95 3,10.95
  pour Top (no thermals): 6.8,12.65 6.8,9.85 3.8,9.85 2.9,10.75 0.2,10.75 0.2,13.15 6.3,13.15
  pour Bottom (no thermals): 7.5,9.55 0.6,9.55 0.2,9.95 0.2,11.05 0.4,11.25 7.7,11.25 7.8,11.15 7.8,9.85
VPP  (via drill 0.3 pad 0.65)
  Top 0.254: IC104.8 11.2,6.35 10.93,6.07 R116.2
  Top 0.305: 8.8,2.5 R112.1 7.95,1.65 6.5,1.65 6.5,4.25 7,4.75 8.6,4.75 9.1,5.25 9.1,5.75 9.43,6.07 R116.2
  Bottom 0.65: v5.1,0.75 v4.3,0.75 v3.5,0.75 | C112.1 5.17,0.75 v5.9,0.75 v6.7,0.75 | C113.1 6.42,1.02 v6.7,0.75 | v6.7,0.75 v7.5,0.75 | v8.3,0.75 7.77,0.75 C114.1 C111.1
  pour Top (isolate 0.254, no thermals): -0.1,0.25 8.9,0.25 8.9,3.05 4.9,3.05 2.4,5.55 -0.1,5.55

### Text on the board
tPlace: Designs Made / In GReece | OpenServoCAN | Power Module
tStop: EL. Pro.